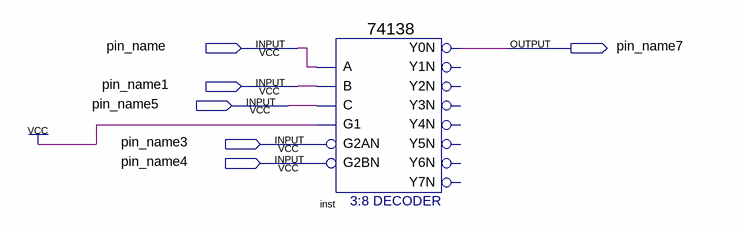
[diagram p0: schematic sheet]
// Quartus schematic 8255A.bdf as structural Verilog: 1 symbols, 6 pins
module \8255A  (
  input  pin_name,
  input  pin_name1,
  input  pin_name5,
  input  pin_name3,
  input  pin_name4,
  output pin_name7
);

  \74138  inst (
    .A(pin_name), .B(pin_name1), .G1(1'b1), .C(pin_name5), .G2AN(pin_name3), .G2BN(pin_name4), .Y0N(pin_name7));  // open: Y1N, Y2N, Y3N, Y4N, Y5N, Y6N, Y7N
endmodule
